# EAGLE board design1 (EAGLE 7.3.0)
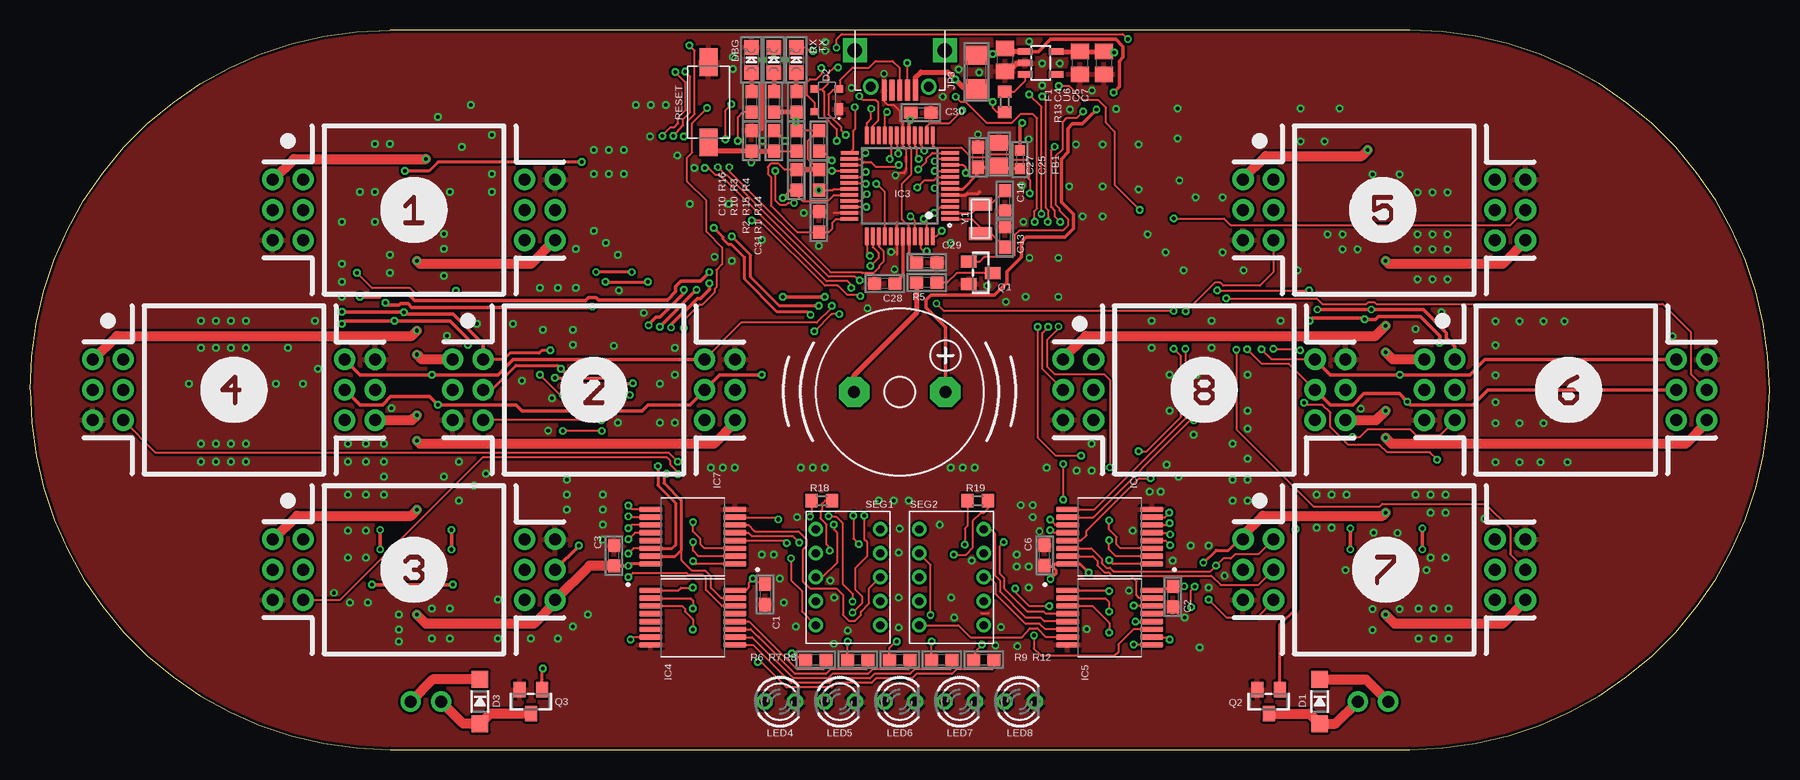
[diagram p3: board, top side]
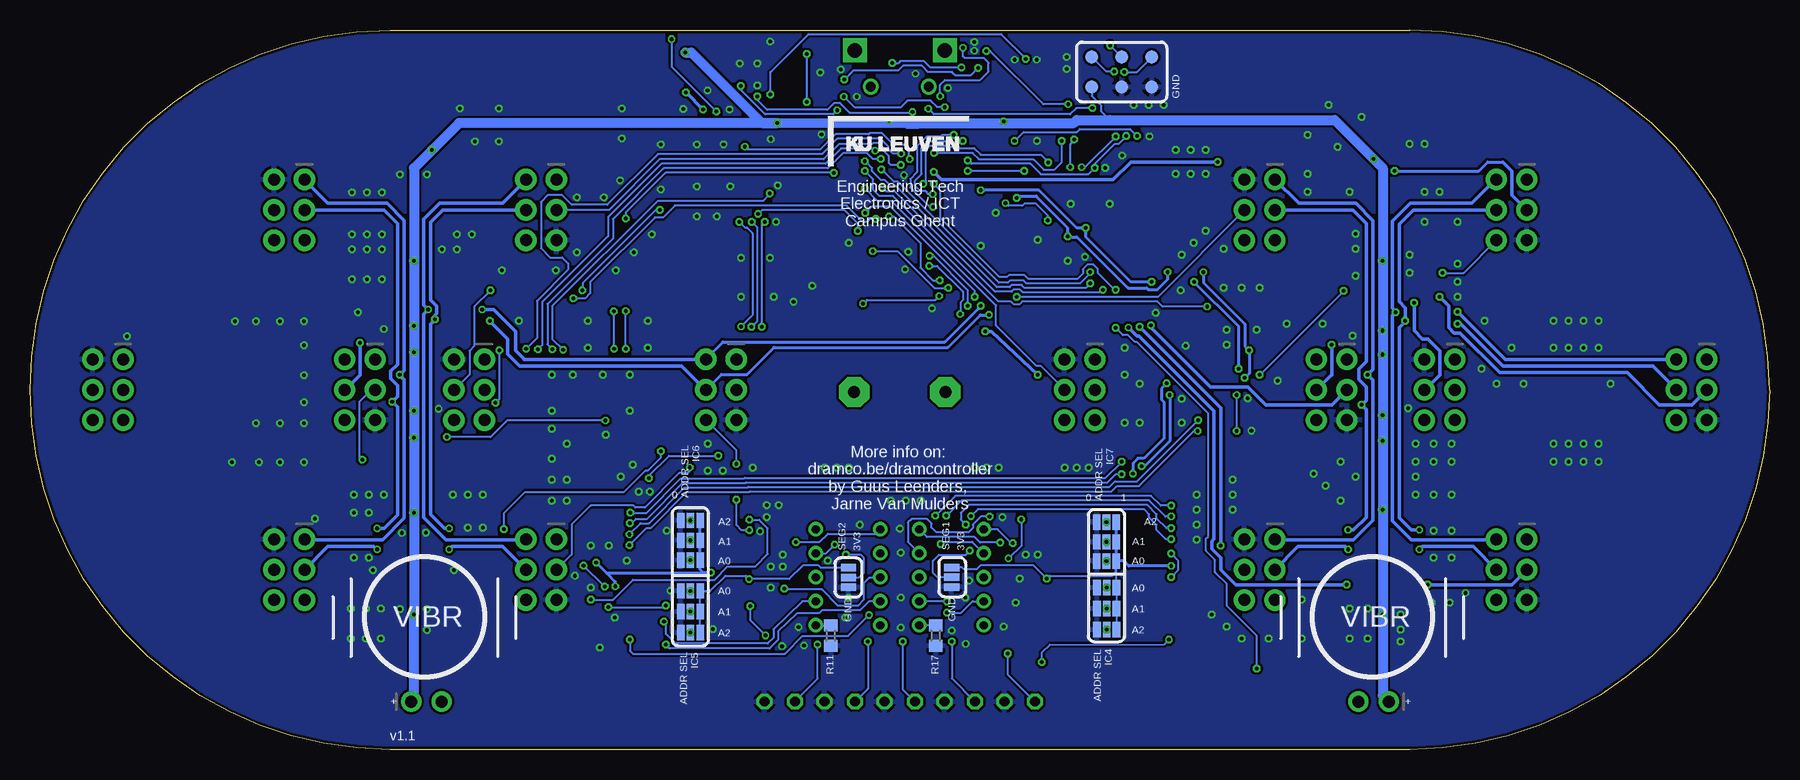
[diagram p4: board, bottom side, seen from below]

Size 145 x 60 mm. Coordinates in mm from the lower left corner, seen from the top.
Outline: 0,30 arc90 30,0 115,0 arc90 145,30 arc90 115,60 30,60 arc90 0,30
Copper layers (1*16): Top 0.035mm / dielectric 1.5mm / Bottom 0.035mm
Design rules "SeeedStudio_2layer_DRU_no_angle_20140221-2 *": minimum track width 6mil, minimum drill 11mil, track to track 1mil, track to pad 1mil, pad to pad 1mil, via to via 1mil, smd to smd 0mil, copper to edge 10mil, drill to drill 10mil, minimum pad ring 10mil, minimum via ring 6mil, stop-mask expansion 2mil, vias tented up to drill 100mil, thermal gap 10mil
Net classes: 0 default: clearance 0.205 mm

## Footprints (pad centres in the part's own frame; a part is rotated, then mirrored left to right if it is on the bottom)
F/CM12P = drill 1.016 pad 2.54 octagon: + 3.81,0; - -3.81,0
0603 = smd 1.1 x 1: 1 -0.85,0; 2 0.85,0
C0805 = smd 1.3 x 1.5: 1 -0.95,0; 2 0.95,0
0805 = smd 1.3 x 1.5: 1 -0.95,0; 2 0.95,0
SOD-123 = smd 1.4 x 1.4: A 1.85,0; C -1.85,0
SOT143B = smd 1 x 0.7: 1 -0.75,-1 | smd 0.6 x 0.7: 2 0.95,-1; 3 0.95,1; 4 -0.95,1
CHIPLED_0805 = smd 1.2 x 1.2: A 0,-1.05; C 0,1.05
1206 = smd 1.6 x 1.8: 1 -1.4,0; 2 1.4,0
_0603 = smd 0.9 x 0.8: 1 -0.762,0; 2 0.762,0
QFP50P900X900X120-48N = smd 1.45 x 0.3: 1 -4.2,2.75; 2 -4.2,2.25; 3 -4.2,1.75; 4 -4.2,1.25; 5 -4.2,0.75; 6 -4.2,0.25; 7 -4.2,-0.25; 8 -4.2,-0.75; 9 -4.2,-1.25; 10 -4.2,-1.75; 11 -4.2,-2.25; 12 -4.2,-2.75; 25 4.17,-2.75; 26 4.2,-2.25; 27 4.2,-1.75; 28 4.2,-1.25; 29 4.2,-0.75; 30 4.2,-0.25; 31 4.2,0.25; 32 4.2,0.75; 33 4.2,1.25; 34 4.2,1.75; 35 4.2,2.25; 36 4.2,2.75 | smd 0.3 x 1.45: 13 -2.75,-4.2; 14 -2.25,-4.2; 15 -1.75,-4.2; 16 -1.25,-4.2; 17 -0.75,-4.2; 18 -0.25,-4.2; 19 0.25,-4.2; 20 0.75,-4.2; 21 1.25,-4.2; 22 1.75,-4.2; 23 2.25,-4.2; 24 2.75,-4.2; 37 2.75,4.2; 38 2.25,4.2; 39 1.75,4.2; 40 1.25,4.2; 41 0.75,4.2; 42 0.25,4.2; 43 -0.25,4.2; 44 -0.75,4.2; 45 -1.25,4.2; 46 -1.75,4.2; 47 -2.25,4.2; 48 -2.75,4.2
SSOP-16 = smd 1.9 x 0.48: 1 -3.505,2.275; 2 -3.505,1.625; 3 -3.505,0.975; 4 -3.505,0.325; 5 -3.505,-0.325; 6 -3.505,-0.975; 7 -3.505,-1.625; 8 -3.505,-2.275; 9 3.505,-2.275; 10 3.505,-1.625; 11 3.505,-0.975; 12 3.505,-0.325; 13 3.505,0.325; 14 3.505,0.975; 15 3.505,1.625; 16 3.505,2.275
SMT-JUMPER_3_NO_NO-SILK = smd 0.635 x 1.27: 1 -0.813,0; 2 0,0; 3 0.813,0
FCI-10103594-0001LF = smd 0.4 x 1.75: 1 -1.3,5.025; 2 -0.65,5.025; 3 0,5.025; 4 0.65,5.025; 5 1.3,5.025 | drill 0.8: P$1 -2.425,4.73; P$2 2.425,4.73 | drill 1.2 pad 2 square: P$3 -3.75,1.7; P$4 3.75,1.7
1X02_ROUND = drill 1 pad 1.676: 1 -1.27,0; 2 1.27,0
2X03_ROUND_70MIL = drill 1 pad 1.778: 1 -2.54,1.27; 2 -2.54,-1.27; 3 0,1.27; 4 0,-1.27; 5 2.54,1.27; 6 2.54,-1.27
LED3MM = drill 0.813 octagon: A -1.27,0; K 1.27,0
SOT23-WIDE = smd 1 x 1.27: 1 -0.95,-1; 2 0.95,-1; 3 0,1
R0603 = smd 1 x 1.1: 1 -0.85,0; 2 0.85,0
434111043826 = smd 2.3 x 1.5: 1 -3.35,0; 2 3.35,0
NAR131SH-F = drill 0.7: 1 -2.685,4; 2 -2.685,2; 3 -2.685,0; 4 -2.685,-2; 5 -2.685,-4; 6 2.685,-4; 7 2.685,-2; 8 2.685,0; 9 2.685,2; 10 2.685,4
TP11R = smd 1.1 x 1.1: TP 0,0
SOT25 = smd 0.55 x 1.2: 1 -0.95,-1.3; 2 0,-1.3; 3 0.95,-1.3; 4 0.95,1.3; 5 -0.95,1.3
XTAL320X150X90 = smd 1.092 x 1.905: 1 -1.219,0; 2 1.219,0

## Placement (x,y rotation side)
BUZZER  F/CM12P  [F/CM12P]  72.5,29.81 0 top
C1  100n  [0603]  61.28,12.94 270 top
C2  100n  [0603]  95.25,12.75 270 top
C3  100n  [0603]  48.67,16.17 90 top
C4  10u  [C0805]  81.25,57.5 270 top
C5  10u  [C0805]  87.5,57.25 270 top
C6  100n  [0603]  84.58,16.19 90 top
C7  10u  [C0805]  89.5,57.25 270 top
C10  100n  [0603]  60.12,50.75 90 top
C13  12p  [0603]  81.25,42.75 270 top
C14  12p  [0603]  81.25,45.75 90 top
C25  10u  [0805]  80.78,49.63 90 top
C27  100n  [0603]  79.03,49.38 90 top
C28  100n  [0603]  71.25,38.86 180 top
C29  100n  [0603]  74.75,40.62 0 top
C30  100n  [0603]  74.26,53.1 0 top
C31  100n  [0603]  65.75,44 90 top
D1  [SOD-123]  107.5,4 270 top
D2  PRTR5V0U2X,215  [SOT143B]  66.43,54.13 90 top
D3  [SOD-123]  37.5,4 270 top
DBG  BLUE  [CHIPLED_0805]  60.12,57.5 0 top
F1  1206L025YR  [1206]  78.88,56.48 270 top
FB1  BLM18PG471SN1D  [_0603]  82.52,49.2 90 top
IC3  ATSAMD21G18A-AF  [QFP50P900X900X120-48N]  72.5,47 180 top
IC4  [SSOP-16]  55.25,11 0 top
IC5  [SSOP-16]  90,11 0 top
IC6  [SSOP-16]  90,17.75 180 top
IC7  [SSOP-16]  55.25,17.75 180 top
JP1  JUMPER-SMT_3_NO_NO-SILK  [SMT-JUMPER_3_NO_NO-SILK]  55.27,18.96 0 bottom
JP2  JUMPER-SMT_3_NO_NO-SILK  [SMT-JUMPER_3_NO_NO-SILK]  55.27,17.3 0 bottom
JP3  USB-RECEPTABLE  [FCI-10103594-0001LF]  72.5,60 180 top
JP4  JUMPER-SMT_3_NO_NO-SILK  [SMT-JUMPER_3_NO_NO-SILK]  55.27,15.71 0 bottom
JP5  [1X02_ROUND]  111.94,4 0 bottom
JP6  JUMPER-SMT_3_NO_NO-SILK  [SMT-JUMPER_3_NO_NO-SILK]  89.95,15.79 0 bottom
JP7  JUMPER-SMT_3_NO_NO-SILK  [SMT-JUMPER_3_NO_NO-SILK]  89.95,17.45 0 bottom
JP8  JUMPER-SMT_3_NO_NO-SILK  [SMT-JUMPER_3_NO_NO-SILK]  89.95,19.1 0 bottom
JP9  [2X03_ROUND_70MIL]  21.5,45 270 bottom
JP10  [2X03_ROUND_70MIL]  42.5,45 270 bottom
JP11  [2X03_ROUND_70MIL]  36.5,30 270 bottom
JP12  [2X03_ROUND_70MIL]  57.5,30 270 bottom
JP13  [2X03_ROUND_70MIL]  21.5,15 270 bottom
JP14  [2X03_ROUND_70MIL]  42.5,15 270 bottom
JP15  [2X03_ROUND_70MIL]  6.5,30 270 bottom
JP16  [2X03_ROUND_70MIL]  27.5,30 270 bottom
JP17  [2X03_ROUND_70MIL]  102.39,15 270 bottom
JP18  [2X03_ROUND_70MIL]  123.39,15 270 bottom
JP19  [2X03_ROUND_70MIL]  117.5,30 270 bottom
JP20  [2X03_ROUND_70MIL]  138.5,30 270 bottom
JP21  [2X03_ROUND_70MIL]  102.39,45 270 bottom
JP22  [2X03_ROUND_70MIL]  123.39,45 270 bottom
JP23  [2X03_ROUND_70MIL]  87.39,30 270 bottom
JP24  [2X03_ROUND_70MIL]  108.39,30 270 bottom
JP25  [1X02_ROUND]  33,4 180 bottom
JP26  JUMPER-SMT_3_NO_NO-SILK  [SMT-JUMPER_3_NO_NO-SILK]  55.25,13.5 0 bottom
JP27  JUMPER-SMT_3_NO_NO-SILK  [SMT-JUMPER_3_NO_NO-SILK]  55.25,11.75 0 bottom
JP28  JUMPER-SMT_3_NO_NO-SILK  [SMT-JUMPER_3_NO_NO-SILK]  55.25,10 0 bottom
JP29  JUMPER-SMT_3_NO_NO-SILK  [SMT-JUMPER_3_NO_NO-SILK]  89.95,9.75 0 bottom
JP30  JUMPER-SMT_3_NO_NO-SILK  [SMT-JUMPER_3_NO_NO-SILK]  89.95,11.5 0 bottom
JP31  JUMPER-SMT_3_NO_NO-SILK  [SMT-JUMPER_3_NO_NO-SILK]  89.95,13.22 0 bottom
LED4  [LED3MM]  62.5,4 0 top
LED5  [LED3MM]  67.5,4 0 top
LED6  [LED3MM]  72.5,4 0 top
LED7  [LED3MM]  77.5,4 0 top
LED8  [LED3MM]  82.5,4 0 top
Q1  [SOT23-WIDE]  79.25,39.75 270 top
Q2  [SOT23-WIDE]  103.25,4 180 top
Q3  [SOT23-WIDE]  41.75,4 180 top
R1  4k7  [0603]  65.75,47.5 270 top
R2  4k7  [0603]  63.88,47.5 270 top
R3  470  [0603]  62,54 270 top
R4  470  [0603]  63.88,54 270 top
R5  10  [0603]  74.75,38.94 180 top
R6  470  [0603]  65.5,7.5 0 top
R7  470  [0603]  69,7.5 0 top
R8  470  [0603]  72.5,7.5 0 top
R9  470  [0603]  76,7.5 0 top
R10  470  [0603]  62,50.75 270 top
R11  470  [R0603]  78.25,9.5 90 bottom
R12  470  [0603]  79.5,7.5 0 top
R13  10k  [R0603]  81.25,54 270 top
R14  100k  [0603]  65.75,50.75 90 top
R15  100k  [0603]  63.88,50.75 90 top
R16  470  [0603]  60.12,54 270 top
R17  470  [R0603]  69.5,9.5 90 bottom
R18  470  [R0603]  66,20.75 0 top
R19  470  [R0603]  79,20.75 0 top
RESET  [434111043826]  56.56,53.96 270 top
RX  BLUE  [CHIPLED_0805]  62,57.5 0 top
SEG1  327-NAR131SHF  [NAR131SH-F]  68.18,14.36 0 top
SEG2  327-NAR131SHF  [NAR131SH-F]  76.8,14.36 0 top
SJ1  JUMPER-SMT_3_NO_NO-SILK  [SMT-JUMPER_3_NO_NO-SILK]  76.78,14.34 90 bottom
SJ2  JUMPER-SMT_3_NO_NO-SILK  [SMT-JUMPER_3_NO_NO-SILK]  68.17,14.36 90 bottom
TP1  TPTP11R  [TP11R]  56.5,55.25 0 bottom
TP2  TPTP11R  [TP11R]  54,55.25 0 bottom
TP3  TPTP11R  [TP11R]  51.5,55.25 0 bottom
TP4  TPTP11R  [TP11R]  56.5,57.75 0 bottom
TP5  TPTP11R  [TP11R]  54,57.75 0 bottom
TP6  TPTP11R  [TP11R]  51.5,57.75 0 bottom
TX  BLUE  [CHIPLED_0805]  63.88,57.5 0 top
U6  LP2985AIM5-3.3  [SOT25]  84.25,57.25 270 top
Y1  ABS07W-32.768KHZ-D-2-T  [XTAL320X150X90]  79.23,44.25 90 top

## Tracks (layer width: path | path; a pad name or v marks a point on that pad's centre or on a via)
+3V3  (via drill 0.31)
  Top 0.152: IC3.36 67.19,44.25 66.88,43.94 66.88,43.44 66.59,43.15 C31.1 63.94,43.16 61.75,45.34 61.75,47.75 61.5,48 61.5,48.56 61.78,48.84 62.41,48.84 62.9,48.35 R1.1 64.81,49.29 64.81,50.75 65.66,51.6 R14.2 63.94,51.6 63.91,51.56 63.91,51.57 | 64.81,48.35 65.72,48.35 65.75,48.38 65.69,48.38 | v73.38,52.48 73.3,52.69 73.33,52.66 | R4.2 63.88,52.44 63.84,52.41 | 63.91,51.57 63.91,52.31 v63.84,52.38 | 63.91,51.57 R15.2 | IC3.44 73.25,43.64 72.69,44.2 72.69,47.2 73.42,47.93 73.42,50.19 73.25,50.36 IC3.17 | v96.22,13.59 v96.21,13.6 C2.1 95.15,13.5 94.75,13.5 94.53,13.28 IC5.16 | 59.97,13.97 v60.25,14.25 | v60.25,14.25 60.5,14 61.07,14 C1.1 | 84.71,15.47 C6.1 | IC4.16 59.69,13.28 59.93,13.52 59.93,13.93 v60.25,14.25
  Top 0.254: IC3.44 73.25,41.4 C29.1 | v88.25,14.75 87.53,15.47 IC6.16 85.47,15.47 85.25,15.25 | v97.81,15.59 97.84,15.59 98.88,16.62 99.91,16.62 100.82,17.54 JP17.1 | 85.25,15.25 84.66,15.25 C6.1 | 85.25,15.25 85.5,15 85.5,14.66 v85.06,14.22 | IC7.16 50.04,15.47 v49.88,15.31
  Top 0.305: FB1.2 82.52,52.06 v82.7,52.25 | C30.1 73.33,52.66 73.41,52.41 73.25,52.25 IC3.17 | C3.1 49.9,15.32 v49.88,15.31
  Top 0.406: R3.2 R4.2 R15.2 | R1.1 64.81,48.35 R2.1 | U6.5 C5.1 C7.1 90.38,58.2 v90.38,58.12 90.35,58.1
  Top 0.813: JP9.1 20.29,47.54 22,49.25 v33,49.25 | JP11.1 32.65,32.54 v32.25,32.94 | JP15.1 5.29,32.54 7.25,34.5 31.81,34.5 v32.25,34.94 | JP16.6 31.84,27.46 v32.25,27.88 | JP13.1 20.29,17.54 22.25,19.5 31.75,19.5 v32.25,20 | v32.25,11.25 33,10.5 42,10.5 43.77,12.27 JP14.6 46.63,15.32 C3.1 | JP12.6 58.77,27.27 57,25.5 32.5,25.5 v32.25,25.75 | JP10.6 43.71,42.46 41.75,40.5 32.5,40.5 v32.25,40.75 | JP21.1 101.12,47.62 103,49.5 111,49.5 v111.5,50 | JP22.6 124.66,42.41 122.75,40.5 113.25,40.5 v113,40.75 | JP24.6 112.21,27.46 v113,28.25 | JP23.1 86.12,32.62 88,34.5 112.16,34.5 v113,35.34 | JP20.6 139.77,27.27 138,25.5 113.5,25.5 v113,26 | JP18.6 124.66,12.41 122.75,10.5 113.75,10.5 v113,11.25 | JP17.1 101.12,17.87 102.75,19.5 112.75,19.5 v113,19.75 | D1.C 111.36,5.85 JP5.1 | D3.C 33.58,5.85 JP25.1 | JP19.1 113.58,32.54 v113,33.12
  Bottom 0.152: v73.38,52.48 73.19,52.38 v63.84,52.38 63.84,52.34 63.75,52.25 | JP26.3 JP27.3 JP28.3 | TP1.TP 56.5,54.5 55.75,53.75 55.75,53.25 55,52.5 | 89.19,9.7 JP29.3 JP30.3 JP31.3 88.31,13.22 87.03,14.5 85.34,14.5 v85.06,14.22 81.72,14.22 80.56,15.38 79.28,15.38 79.06,15.16 SJ1.3 | SJ2.3 67.31,15.19 67.16,15.03 66.09,15.03 65.78,15.34 61.34,15.34 v60.25,14.25 60,14.5 54.78,14.5 54.47,14.81 54.47,15.7 JP4.3 54.45,13.52
  Bottom 0.254: JP1.3 JP2.3 JP4.3 53.81,15.72 53.41,15.31 v49.88,15.31 | JP8.3 JP7.3 JP6.3 89.16,15.77 89.16,15.03 88.88,14.75 v88.25,14.75 88.5,14.69 96.91,14.69 | 96.91,14.69 v97.81,15.59 | v96.21,13.6 96.21,13.99 96.91,14.69 | 54.45,13.52 JP26.3
  Bottom 0.813: v90.38,58.12 89.88,58.12 84,52.25 v82.7,52.25 | v82.7,52.25 71.91,52.25 71.83,52.17 71.04,52.17 70.96,52.25 63.75,52.25 58,52.25 57.75,52.5 55,52.5 36.25,52.5 v33,49.25 32.25,48.5 v32.25,40.75 v32.25,34.94 v32.25,32.94 v32.25,27.88 v32.25,25.75 v32.25,20 v32.25,11.25 32.25,4.52 JP25.1 | v82.7,52.25 109.25,52.25 v111.5,50 113,48.5 v113,40.75 v113,35.34 v113,33.12 v113,28.25 v113,26 v113,19.75 v113,11.25 113,4.25 113.21,4.04 JP5.1
+5V  (via drill 0.31)
  Top 0.152: R13.2 80.6,53.15 80.25,53.5 v80.25,54 | v80.25,58 80,57.9 80.01,57.88
  Top 0.305: BUZZER.+ 76.31,35.24 74.69,36.85 74.69,37.49 75.09,37.89 80.41,37.89 81.44,38.92 81.44,39.87 82.63,41.06 82.63,42.33 83.03,42.73 86.28,42.73 87,43.44 87,44.63 85.96,45.66 85.96,49.24 86.52,49.79 86.52,51.78 86.92,52.17 87.71,52.17 v88.9,53.36 | v90.33,54.79 90.81,55.27 90.81,57.41 91.12,57.73 91.12,58.6 90.52,59.21 85.06,59.21 84.05,58.2 U6.1
  Top 0.406: F1.1 80.01,57.88 80.25,58.12 80.97,58.12 80.97,58.2 81.25,58.2 | U6.1 81.25,58.2 | 81.25,58.2 C4.1
  Bottom 0.152: v80.25,54 v80.25,58
  Bottom 0.305: v88.9,53.36 v90.33,54.79
A0  (via drill 0.31)
  Top 0.152: IC3.3 75.88,45.25 v75.38,44.75
  Top 0.305: v62.75,37.75 v66.25,37.75
  Bottom 0.152: JP10.4 43.77,44.98 51,37.75 v62.75,37.75 | v66.25,37.75 66.25,38.25 73.28,45.28 74.84,45.28 v75.38,44.75 75.22,44.91
A1  (via drill 0.31)
  Top 0.152: v75.41,46.81 75.84,47.25 IC3.7
  Bottom 0.152: JP12.4 58.77,30.02 60.75,32 61.09,32 64.47,35.38 64.47,37.03 73.19,45.75 74.34,45.75 v75.41,46.81
A2  (via drill 0.31)
  Top 0.152: v73.97,46.88 74.56,47.47 75.34,47.47 75.53,47.66 75.66,47.66 75.75,47.75 IC3.8
  Top 0.305: JP14.4 43.77,15.02 v45.75,17 | v52.5,35.25 52.5,35.28 v55.56,38.34
  Bottom 0.152: v55.56,38.34 55.75,38.12 62.25,38.12 62.5,38.38 63,38.38 63.19,38.19 64.56,38.19 72.91,46.53 73.62,46.53 v73.97,46.88
  Bottom 0.305: v45.75,17 45.75,28.5 v52.5,35.25
A3  (via drill 0.31)
  Top 0.152: v75.41,48.25 IC3.9
  Top 0.305: v29.62,37.25 29.81,37.06 30.75,37.06 30.88,37.19 31.5,37.19 31.81,36.88 46.81,36.88 v46.88,36.94
  Bottom 0.152: v46.88,36.94 50.59,36.94 51.03,37.38 62.28,37.38 62.53,37.12 63,37.12 63.25,37.38 64.28,37.38 73.06,46.16 74.19,46.16 74.72,46.69 74.72,47.56 v75.41,48.25
  Bottom 0.305: JP16.4 28.75,30 27.5,31.25 27.5,33.25 28.5,34.25 28.94,34.25 29.62,34.94 v29.62,37.25
A4  (via drill 0.31)
  Top 0.152: v78,48.09 78,48.53 77.78,48.75 IC3.10 | v95.34,44.28 99.53,44.28 100.06,43.75 123.41,43.75 JP22.4
  Bottom 0.152: v78,48.09 92.03,48.09 95.34,44.78 v95.34,44.28
A5  (via drill 0.31)
  Top 0.152: IC3.47 74.75,44 v74.5,44.25 | v99.72,37.62 107.25,37.62 107.72,37.16 111.41,37.16 111.56,37.31 112.06,37.31 112.22,37.16 136.09,37.16 138.44,34.81 138.44,31.33 JP20.4
  Bottom 0.152: v74.5,44.25 75,44.25 75.25,44 75.56,44 76.94,45.38 91.25,45.38 92.25,44.38 92.91,44.38 98.31,38.97 98.31,38.06 98.75,37.62 v99.72,37.62
A6  (via drill 0.31, 0.31 pad 0.3)
  Top 0.152: v100.56,33.34 100.56,26.69 106.97,20.28 112.5,20.28 112.72,20.5 121.31,20.5 123.38,18.44 123.38,16.29 JP18.4 | IC3.13 75.25,50.34 75.41,50.19 77.63,50.19 78.42,49.4 79.69,49.4 79.93,49.63 81.68,49.63 81.84,49.47 81.84,49.32 81.95,49.2 83.07,49.2 83.26,49 83.26,47.57 83.34,47.49 v83.34,46.38
  Bottom 0.152: v100.56,33.34 101.47,34.25 101.47,36.97 92.69,45.75 83.9,45.75 83.34,46.31 v83.34,46.38
A7  (via drill 0.31)
  Top 0.152: IC3.14 74.75,52 75,52.25 76.66,52.25 v77.72,53.31 | v85.75,55.34 86.6,55.34 87.79,54.16 89.06,54.16 89.69,53.52 89.69,52.25 90.41,51.54 90.41,47.09 v92.5,45 | v98.97,38.28 v106.62,38.28
  Bottom 0.152: v77.72,53.31 78.06,52.97 83.72,52.97 85.75,55 v85.75,55.34 | v106.62,38.28 107.97,36.94 107.97,33.66 108.38,33.25 108.38,31.29 JP24.4 | v92.5,45 92.84,45 98.94,38.91 98.94,38.31 v98.97,38.28
A_1  (via drill 0.31)
  Top 0.152: v81.16,17.28 80.84,16.97 80.84,14.66 81.22,14.28 81.22,13.41 83.12,11.5 84.5,11.5 84.67,11.32 IC5.4
  Bottom 0.152: v81.16,17.28 79.22,17.28 78.5,18 74.47,18 SEG2.1
A_2  (via drill 0.31)
  Top 0.152: IC7.4 62.86,17.43 v63.08,17.2
  Bottom 0.152: v63.08,17.2 63.17,17.2 64.34,18.38 65.48,18.38 SEG1.1
B_1
  Top 0.152: SEG2.10 79.5,18.34 80.09,18.34 80.47,17.97 80.47,14.5 80.84,14.12 80.84,13.19 83.03,11 84.25,11 84.58,10.68 IC5.5
B_2  (via drill 0.31)
  Top 0.152: IC7.5 59.9,18.07 60.17,17.8 63.57,17.8 v64.12,17.25
  Bottom 0.152: SEG1.10 70.25,17.72 66.28,17.72 65.81,17.25 v64.12,17.25
BUZZER_EN  (via drill 0.31 pad 0.3)
  Top 0.152: IC3.23 70.25,52.02 70.72,52.49 70.72,53.92 70.48,54.16 69.45,54.16 v69.14,54.48 | v67.23,58.52 67.23,59.24 67.65,59.66 91.1,59.66 v91.52,59.24 | v87.79,53.2 87.23,52.65 86.36,52.65 86.04,52.33 86.04,50.03 85.49,49.47 85.49,45.43 85.8,45.11 85.8,44.95 86.52,44.24 86.52,43.68 86.12,43.28 82.47,43.28 82.07,42.89 82.07,41.22 81.92,41.06 79.53,41.06 79.17,40.7 Q1.1
  Bottom 0.152: v67.23,58.52 67.23,57.81 67.07,57.65 65.48,57.65 65.09,57.25 65.09,56.54 65.8,55.82 68.74,55.82 69.14,55.43 v69.14,54.48 | v91.52,59.24 91.52,56.94 v87.79,53.2
C_1
  Top 0.152: SEG2.8 79.99,14.36 80.47,13.88 80.47,13 82.97,10.5 84.16,10.5 84.63,10.03 IC5.6
C_2
  Top 0.152: SEG1.8 69.95,13.44 69.95,12.2 69.25,11.5 69.25,11.25 68.75,10.75 68.25,10.75 67.75,11.25 67.75,12.91 67.24,13.42 65.03,13.42 64.45,13.99 64.45,16.69 64.77,17.01 64.77,17.48 64.05,18.2 60.4,18.2 59.88,18.73 IC7.6
COMMON1  (via drill 0.31)
  Top 0.152: R19.1 78.15,18.65 77.92,18.42 v77.92,17.08
  Bottom 0.152: SEG2.9 78.64,16.36 v77.92,17.08
COMMON2  (via drill 0.31)
  Top 0.152: R18.1 65.15,19.56 v65.01,19.42
  Bottom 0.152: v65.01,19.42 65.75,19.42 66.41,18.76 66.41,18.47 66.75,18.12 69.45,18.12 69.83,18.5 69.84,18.5 69.84,18.84 70.25,19.25 71.5,19.25 71.83,18.92 71.83,17.32 SEG1.9
D0  (via drill 0.31)
  Top 0.152: IC3.29 69.25,47.75 v69.67,48.17
  Top 0.254: v46,49 34,49 33.25,48.25 v31.25,48.25
  Bottom 0.254: v31.25,48.25 24.25,48.25 23.5,49 22.25,49
  Bottom 0.305: JP9.3 20.25,45 21.5,46.25 21.5,48.25 22.25,49 | v46,49 53.25,49 54.72,47.53 69.03,47.53 v69.67,48.17
D1  (via drill 0.31)
  Top 0.152: IC3.30 69.59,47.25 v69.67,47.17
  Top 0.305: v51.56,35.38 51.56,35.44 52.19,36.06 52.5,36.06 54.5,38.06 v54.5,38.34
  Bottom 0.152: 54.56,38.31 56,39.75 56,40.06 56.38,40.44 56.88,40.44 57.25,40.06 57.25,39.69 57.69,39.25 61.78,39.25 62.09,39.56 63.41,39.56 63.56,39.41 64.19,39.41 69.09,44.31 69.09,46.59 v69.67,47.17
  Bottom 0.305: JP11.3 35.25,30 36.5,28.75 42,28.75 43.5,30.25 46.62,30.25 51.56,35.19 v51.56,35.38 | v54.5,38.34 54.56,38.31
D2  (via drill 0.31)
  Top 0.152: IC3.11 75.59,49.25 v75.41,49.06
  Top 0.305: v28.5,13.75 v35.25,13.75 | v53.44,35.19 53.44,35.44 55.62,37.62 55.88,37.62 56.62,38.38 v56.62,38.88
  Bottom 0.152: v56.62,38.88 57,38.5 62.09,38.5 62.34,38.75 63.16,38.75 63.34,38.56 64.41,38.56 72.81,46.97 73.22,46.97 73.75,47.5 74.06,47.5 74.81,48.25 74.81,48.5 75.38,49.06 v75.41,49.06
  Bottom 0.305: JP13.3 20.25,15 21.5,13.75 v28.5,13.75 | v35.25,13.75 44.5,13.75 45.75,15 45.75,16 46.5,16.75 46.5,17.38 46.31,17.56 46.31,28.25 52.56,34.5 52.75,34.5 v53.44,35.19
D3  (via drill 0.31)
  Top 0.152: IC3.12 75.22,49.75 74.69,49.22 74.69,48.99 74.07,48.38 v74.03,48.38
  Top 0.305: v27.5,37.75 29.12,37.75 29.38,38 31.5,38 32.06,37.44 46.31,37.44 46.56,37.69 47.19,37.69 47.38,37.5 53.12,37.5 53.81,38.19 53.81,38.62 54.25,39.06 55.88,39.06 v56.62,39.81
  Bottom 0.152: v56.62,39.81 56.62,39.75 57.5,38.88 61.94,38.88 62.19,39.12 63.31,39.12 63.5,38.94 64.25,38.94 72.66,47.34 73,47.34 v74.03,48.38
  Bottom 0.305: JP15.3 5.25,30 6.5,28.75 9.19,28.75 11.88,31.44 22.5,31.44 25.81,34.75 26.31,34.75 26.75,35.19 26.75,37 v27.5,37.75
D4  (via drill 0.31)
  Top 0.152: IC3.27 69.28,48.75 69.53,49 70.09,49 70.48,48.6 72.27,48.6 v72.42,48.75
  Bottom 0.152: v72.42,48.75 73.25,48.75 73.41,48.91 73.41,49.5 73.84,49.94 73.84,50.16 74.25,50.56 74.75,50.56 74.81,50.5 77.56,50.5 78.84,49.22 92.53,49.22 96.75,45 JP21.3
D5  (via drill 0.31 pad 0.3)
  Top 0.152: IC3.19 72.25,49.83 v72.38,49.7 | v117.3,24.17 116.69,24.78 113.12,24.78 112.49,25.41 109.9,25.41 108.41,26.91 108.41,28.08 107.75,28.75 106.38,28.75 v106.2,28.92 | v103.64,33.41 105.76,33.41 v105.89,33.28
  Bottom 0.152: v72.38,49.7 73.07,49.7 73.46,50.08 73.46,50.28 74.12,50.94 74.88,50.94 74.9,50.92 77.72,50.92 78.99,49.65 92.66,49.65 96.88,45.44 99.85,45.44 100.64,46.22 101.85,46.22 102.41,45.66 102.41,41.8 101.65,41.04 100.64,41.04 100.13,40.53 100.13,40.02 102.75,37.4 102.75,34.3 v103.64,33.41 | JP19.3 116.55,30 117.55,29 117.55,24.38 117.35,24.17 v117.3,24.17 | v105.89,33.28 105.89,29.23 v106.2,28.92
D6  (via drill 0.31 pad 0.3)
  Top 0.152: IC3.20 71.75,49.31 v71.68,49.24 | v85.41,50.27 85.09,49.95 85.09,45.27 85.41,44.95 85.41,44.47 v85.88,44 | v85.72,35.27 85.72,35.11 84.77,34.16 84.77,31.93 85.41,31.3 89.53,31.3 90.01,30.82 v90.01,23.52
  Bottom 0.152: v85.41,50.27 85.17,50.03 79.14,50.03 77.87,51.3 75.09,51.3 75.01,51.38 73.98,51.38 73.03,50.43 72.15,50.43 71.75,50.03 71.75,49.32 v71.68,49.24 | v85.88,44 85.41,43.52 85.25,43.52 84.77,43.05 84.77,36.22 v85.72,35.27 | v90.01,23.52 90.01,23.2 90.17,23.04 90.88,23.04 93.74,20.18 94.54,20.18 94.69,20.34 98.27,20.34 99.85,18.76 99.85,16.27 JP17.3
D7  (via drill 0.31)
  Top 0.152: IC3.21 71.25,52.97 v71.44,53.16 | JP23.3 84.38,31.75 84.38,34.75 v84.88,35.25 | v84.84,44 84.84,44.34 84.91,44.41 84.91,44.94 84.69,45.16 84.69,54.16 v84.38,54.47
  Bottom 0.152: v84.88,35.25 84.38,35.75 84.38,43.53 v84.84,44 | v84.38,54.47 84.38,54.16 83.56,53.34 78.53,53.34 77.97,53.91 77.47,53.91 76.69,53.12 71.47,53.12 v71.44,53.16
D_1
  Top 0.152: SEG2.5 77.39,10.36 78.38,9.38 82.69,9.38 83.34,10.1 83.98,10.1 84.71,9.38 IC5.7
D_2  (via drill 0.31)
  Top 0.152: v63.44,15.94 63.44,14.12 64.34,13.22 64.34,11.51 SEG1.5 | IC7.7 62.19,19.38 v62.38,19.19
  Bottom 0.152: v62.38,19.19 62.38,17 v63.44,15.94
DEBUG_LED  (via drill 0.31)
  Top 0.152: 60.5,53.12 R16.2 59.4,53.15 59,52.75 v59,50.75 | IC3.26 69.25,49.25 69.64,49.64 v69.64,49.75
  Bottom 0.152: v69.64,49.75 66.44,49.75 65.91,49.22 61.38,49.22 60.5,48.34 59.62,48.34 59,48.97 v59,50.75
DP_1  (via drill 0.31)
  Top 0.152: v92.15,10.66 93.49,10.66 IC5.12
  Bottom 0.152: SEG2.7 80.61,12.36 83.03,10.03 83.03,9.31 83.5,8.83 91.2,8.83 92,9.63 92,10.5 v92.15,10.66
DP_2  (via drill 0.31)
  Top 0.152: v68.56,12.34 68.56,13 67.74,13.82 67.74,18.89 67.22,19.41 66.62,19.41 v66.56,19.47 | IC7.12 50.42,18.07 v49.88,17.53
  Bottom 0.152: v66.56,19.47 66,20.03 52.12,20.03 51.72,19.62 51.72,19.38 51.09,18.75 51.09,18.31 50.31,17.53 v49.88,17.53 | v68.56,12.34 70.85,12.34 SEG1.7
E_1  (via drill 0.31)
  Top 0.152: v92,8.76 93.47,8.76 IC5.9
  Bottom 0.152: SEG2.4 75.06,12.36 75.8,11.61 78.98,11.61 79.22,11.37 81.04,11.37 82.63,9.87 82.63,9.15 83.34,8.44 91.68,8.44 v92,8.76
E_2  (via drill 0.31)
  Top 0.152: v69.53,19.5 69.53,17.56 69.75,17.34 69.75,16.09 68.78,15.12 68.78,13.34 69.34,12.78 69.34,12.19 v68.56,11.41 | IC7.9 50.19,20.02 v49.88,20.34
  Bottom 0.152: v49.88,20.34 50.75,20.34 51.56,21.16 67.88,21.16 v69.53,19.5 | v68.56,11.41 67.39,11.41 66.42,12.38 65.51,12.38 SEG1.4
F_1  (via drill 0.31)
  Top 0.152: v75.06,11.22 75.06,15.41 SEG2.2 | IC5.10 94.78,9.38 v95,9.16
  Bottom 0.152: v95,9.16 95,8.25 94.75,8 82.07,8 80.6,9.47 76.81,9.47 v75.06,11.22
F_2  (via drill 0.31)
  Top 0.152: v68.62,19.5 68.62,17.59 v69.09,17.12 | IC7.10 49.94,19.38 v49.88,19.44
  Bottom 0.152: v68.62,19.5 67.34,20.78 51.72,20.78 50.38,19.44 v49.88,19.44 | SEG1.2 66.47,17.33 68.89,17.33 v69.09,17.12
G_1  (via drill 0.31)
  Top 0.152: v82.12,13.41 82.12,13.12 83.29,11.96 v84.97,11.96 | IC5.11 92,10.03 90.73,8.76 90.73,8.12 90.41,7.8 84.3,7.8 83.66,8.44 83.68,8.46 v83.68,9.51
  Bottom 0.152: SEG2.3 74.13,14.34 75.06,14.34 75.06,14.31 75.53,13.84 75.53,12.47 76,12 77.66,12 79,13.34 82.06,13.34 v82.12,13.41 | v84.97,11.96 84.97,10.8 v83.68,9.51
G_2  (via drill 0.31)
  Top 0.152: SEG1.3 65.51,14.34 66.03,14.34 67.31,15.62 67.31,18.04 67,18.35 v67,18.75 | v49.88,18.48 v49.88,18.47 50.13,18.73 IC7.11
  Bottom 0.152: v67,18.75 67.41,19.16 67.41,19.75 66.75,20.41 51.88,20.41 51.09,19.62 51.09,19.28 50.28,18.47 v49.88,18.47
GND  (via drill 0.31)
  Top 0.152: JP3.5 71.2,54.05 71.5,53.75 72,53.75 72.5,53.25 72.5,52.42 72.75,52.17 IC3.18 72.75,50.3 73.03,50.03 73.03,48.36 72.87,48.05 72.06,48.05 v72.14,47.89 | 72.25,41.5 IC3.42 72.25,44 | 72.25,41.5 72.25,41.25 | IC3.35 67,44.75 | C10.2 60.85,51.6 61,51.75 | v71.78,41.5 72.25,41.5 | C2.2 95.25,11.75 96,11 v96.25,11 | 79.3,11.37 79.93,11.37
  Top 0.254: IC3.5 78,46.25 78.12,46.38 79,46.38 | 61.06,53.94 61.06,57.5
  Top 0.305: 79,46.38 79.12,46.5 | 61,51.75 61,53.88 61.06,53.94
  Top 0.406: U6.2 82.25,57.25 81.55,56.55 C4.2
  other vias: 66.25,23.5 62.5,14.25 75.83,18.74 41,30.75 52.5,30.5 37.25,35.5 40.25,35.5 61,16.25 62,16.25 98.25,13.5 98.25,17 66.72,14.09 72.49,18.41 72.41,16.41 72.41,12.66 72.41,10.16 68.16,9.91 67,8.81 62.84,12.25 63.84,10.25 96.75,17 95.25,15.75 30.75,9 30.75,11.25 30.75,10 33.5,11.75 33.5,9.25 35,9.25 35,11.75 39,12.5 39,9.25 41.75,9.25 44,9.25 45.25,10.25 46.5,11.25 47.75,17.5 47.75,18.75 47.75,20 44.75,20 44.75,21.25 44.75,22.5 47.75,21.25 35.75,20.75 37,22 38,23 34.5,22.75 35.75,24 29.5,24 29.5,22.75 29.5,21.25 28,21.25 26.5,21.25 28,18.25 26.5,18.25 28,16 26.5,16 25.34,13.06 26.66,12.25 28.16,12.25 28,24 26.5,24 26.5,25.5 28,25.5 29.5,25.5 14.25,25.5 15.5,25.5 16.75,25.5 18,25.5 18,24 16.75,24 15.5,24 14.25,24 13.25,30.5 14.25,33.5 15.5,33.5 16.75,33.5 20.5,30.5 18,33.5 14.25,35.75 15.5,35.75 16.75,35.75 18,35.75 21.5,33.5 23.75,35.75 22.75,30.5 24,31.75 26,37.75 26,39 26,40.5 26,44 28.75,44 30,41.25 30,39.75 34.5,43 34.5,41.75 34.5,39.5 35,46.5 38.5,48 38.5,46.5 36,50.25 38.5,51.25 36.75,53.75 34,52.75 28.75,46.5 27.5,46.5 30,50.5 28.75,50.5 45.25,35 45.25,33.75 42.75,35 45.5,38.5 44,38.5 42.5,38.5 45.5,41.75 47,43.25 48,42.25 49,41.25 48.25,48 47,48 49.5,48 49.5,50 48.25,50 47,50 56.75,23.5 57.75,23.5 58.75,23.5 76.75,23.5 77.75,23.5 78.75,23.5 65.25,23.5 64.25,23.5 84.75,23.5 87.25,23.25 88.5,23.25 93.33,21.5 94.25,21.5 95.75,22.75 94.75,23.75 100.25,22.5 100.25,20.75 101.5,20.75 101.5,22.5 107.25,21.25 108.5,21.25 109.75,21.25 108.5,18.5 107.25,18.5 115.5,21.25 116.75,21.25 118,21.25 118,19.75 116.75,19.75 118,16 116.75,16 118.25,11.75 117,11.75 117,9.25 118.25,9.25 115.75,9.25 115.75,11.75 114,18.06 112,18.09 117.66,36.47 122.16,33.72 122.16,35.72 124.16,35.72 122.16,31.22 122.16,28.97 122.16,27.22 124.16,27.22 126.16,27.22 126.16,35.72 127.91,35.72 97.5,8.5 82.25,15.25 83.25,15.25 82.25,16.25 82.59,20.39 83.59,20.39 83.59,19.39 115.66,39.22 116.91,39.22 118.16,39.22 118.16,41.72 116.91,41.72 115.66,41.72 115.66,42.97 116.91,42.97 118.16,42.97 115.66,46.47 116.91,46.47 118.16,46.47 110.66,41.72 109.41,41.72 109.41,42.97 108.16,42.97 111.91,47.97 114.16,47.97 105.91,50.72 109.16,53.47 105.91,53.47 109.66,14.97 111.91,11.72 111.91,9.97 116.41,14.97 114.16,11.72 107.91,50.72 100.25,25.5 101.5,24.25 101.5,26.75 101.5,28.25 101.5,31.25 99.75,31.25 97.25,31.25 95,31.25 95,28.25 97,26.25 98.5,33.5 93.5,33.5 98.5,35.75 93.5,35.75 122.16,23.97 124.16,23.97 125.91,23.97 128.16,23.97 101.16,39.97 99.41,41.47 94.66,41.47 96.16,39.97 93.16,42.97 99.41,46.05 97.16,46.05 95.81,47.47 95.66,50.97 95.66,53.47 92.41,46.72 82.67,47.05 82.81,44 89.41,44.47 89.41,46.97 86.63,46.97 87.74,44.47 87.19,50.47 89.41,50.47 92.41,50.47 64.5,44.75 68.49,55.16 66.29,58.27 66.29,59 58.59,56.75 83.25,50.9 76.09,54.44 77.41,56.72 83.3,59.03 79.02,51.3 72.06,40.03 61,42.5 58.5,40.75 58.25,45.5 55,45.5 61.06,50.75 58.59,57.75 79.12,56.47 84.38,55.38 84.38,57.22 88.52,54.95 85.84,57.22 86.69,53.38 90.54,53.41 53.75,33.5 53.75,31.25 48.66,33.66 51.16,36.41 49.09,38.28 57.06,41.09 65.75,42 76.75,42.25 81.35,37.34 83,37.75 83.32,41 85.73,41 85.73,37.75 53.97,49.53 55.38,48.5 53,53.75 51.75,53.75 50.5,53.75 69.81,36.78 43.19,26.59 43.5,29.28 80.48,8.66 78.5,15.75 76.78,12.66 83.25,13.5 77.04,11 70.75,20.75 72,20.75 73.25,20.75 63.94,19.38 51.69,51.12 52.5,27.25 53.75,27.25 49,27.25 49,29.25 88.5,25.5 104.25,35.75 115.5,35.06 110.94,28.41 105.66,39.97 136.91,34.47 121.25,19.25 30.12,28.47 34.75,34.5 61.09,57.52 99.58,14.49 67.04,12.66 88.08,10.04 80.94,10.2 91.93,18.24 91.61,13.24 84.15,18.19 82.3,8.61 71.19,56.35 62.92,57.52 79.8,38.66
  pour Bottom: -11.11,60.77 177.48,60.77 177.23,-0.92 -11.36,-0.92
  pour Top: -18.23,60.89 196.08,60.89 196.08,-0.9 -18.23,-0.9
I2C_SCL  (via drill 0.31)
  Top 0.152: R2.2 64,46.12 | 64,46.12 64.38,45.75 66.5,45.75 67,46.25 IC3.32 | JP17.2 102.4,16.28 100.44,16.28 100.09,15.94 99.47,15.94 v98.86,15.33 98.41,14.88 90.31,14.88 90.03,15.16 89.72,15.16 89.34,15.53 89.34,15.91 88.47,16.77 IC6.14 | 64,46.12 64,46.53 | v96.78,11.88 96.78,13.28 v97.09,13.59 | v49.88,14.38 50.25,14.75 54.73,14.75 54.92,14.56 56.09,14.56 56.34,14.31 56.34,13.31 57.68,11.97 IC4.14 | IC5.14 92.03,11.97 v92,12 | IC7.14 50.31,16.77 v49.88,16.34
  Top 0.254: 64,46.53 63.84,46.69 63.44,46.69 v62.75,46 | v50.16,39.81 v47.19,39.81 | v43.38,33.28 42.66,33.28 42.44,33.06 40,33.06 39.47,32.53 JP11.2 | v43.75,31 48.5,31 49.94,29.56 v50,29.56 | v52.34,23.62 52.34,22.03 53.81,20.56 53.81,17.06 53.52,16.77 IC7.14 | v65.75,37 62.47,37 60.06,39.41 60.06,41.22 v58.5,42.78
  Top 0.305: JP19.2 118.77,33.59 118.06,34.3 118.06,34.75 116.12,36.69 v111.81,36.69 v107.31,36.69 | JP11.2 37.77,33.79 35.25,36.31 31.31,36.31 v31.16,36.47 31.12,36.5 v26,36.5
  Bottom 0.152: v97.09,13.59 97.12,13.59 v98.86,15.33 | v49.88,14.38 49.28,14.97 49.28,15.75 v49.88,16.34 | v96.78,11.88 92.12,11.88 v92,12
  Bottom 0.254: v62.75,46 62.75,46.03 62.62,46.16 61.12,46.16 61.12,46.12 58.5,43.5 v58.5,42.78 58.47,42.75 57.75,42.75 53.47,38.5 51.94,38.5 51.78,38.34 51.03,38.34 50.16,39.22 v50.16,39.81 | v47.19,39.81 47.19,38.94 43.72,35.47 43.72,33.62 v43.38,33.28 43.38,31.38 v43.75,31 | v50,29.56 50,25.72 52.09,23.62 v52.34,23.62 | JP23.2 88.66,32.59 87.25,34 68.75,34 v65.75,37
  Bottom 0.305: JP17.2 103.7,17.5 110.31,17.5 112.19,19.38 112.19,36.31 v111.81,36.69 112.19,37.06 112.19,44.25 110.88,45.56 105.62,45.56 103.66,47.53 JP21.2 | JP23.2 103.8,32.54 103.8,32.55 104.54,33.28 104.54,34.87 106.36,36.7 v107.31,36.69 | 31.16,36.53 31.12,36.5 v31.16,36.47 | v31.16,36.47 31.44,36.19 31.44,19.06 29.88,17.5 22.81,17.5 JP13.2 | JP9.2 22.84,47.54 24.81,45.56 29.94,45.56 31.44,44.06 31.44,36.81 31.16,36.53 | v31.16,36.47 31.16,36.53 | JP15.2 22.04,32.54 v26,36.5
I2C_SDA  (via drill 0.31)
  Top 0.152: IC3.31 67,46.75 66.9,46.65 R1.2 | 91.76,14.5 90.16,14.5 89.88,14.78 89.56,14.78 88.97,15.38 88.97,15.75 88.59,16.12 IC6.15 | 91.76,14.5 98.47,14.5 99.25,13.72 102.38,13.72 JP17.4 | 54.28,17.12 54.31,17.09 54.31,15.78 55.16,14.94 56.25,14.94 56.75,14.44 56.75,13.5 57.62,12.62 IC4.15 | IC5.15 92.49,12.62 92.23,12.88 92.23,14.02 91.76,14.5
  Top 0.254: 38.47,30 40.5,32.03 43.97,32.03 v44.25,31.75 44.28,31.75 44.53,31.5 48.69,31.5 49.66,30.53 v50.25,30.53 | v47.97,39 v51.5,39 | v53.06,23 52.84,22.78 52.84,22.22 54.28,20.78 54.28,17.12 54.28,16.62 53.78,16.12 IC7.15 | v65.06,36.25 64.81,36.5 62.28,36.5 59.56,39.22 59.56,41.03 58.47,42.12 58.22,42.12 57.78,42.56 57.78,42.72 v57,43.5 | R1.2 65.75,46.56 66.09,46.22 66.09,46.31 R1.2
  Top 0.305: v110.06,18.44 v110.06,16.69 | v117.5,33.91 117.5,34.5 115.88,36.12 112.38,36.12 112.12,35.88 v111.25,35.88 111.16,35.97 106.89,35.97 v106.68,35.75 | v29.19,18.31 v29.19,16.69 | v36.5,33.75 36.5,34.25 35,35.75 v30.38,35.75 26.25,35.75 v26,35.5 | 38.47,30 JP11.4
  Bottom 0.254: v44.25,31.75 44.25,35.28 v47.97,39 | v51.5,39 53.25,39 57,42.75 v57,43.5 57.75,43.5 60.91,46.66 R1.2 | v50.25,30.53 50.69,30.09 50.69,29.19 50.5,29 50.5,25.94 52.16,24.28 52.66,24.28 53.06,23.88 v53.06,23 | JP23.4 87.38,31.28 85.25,31.28 83,33.53 68.5,33.53 65.78,36.25 v65.06,36.25
  Bottom 0.305: JP21.4 110.62,45 111.62,44 111.62,37.5 111.12,37 111.12,36.38 111.25,36.25 v111.25,35.88 111.62,35.5 111.62,19.62 110.44,18.44 v110.06,18.44 | v110.06,16.69 109.81,16.94 105.6,16.94 JP17.4 | JP19.4 118.75,30 117.5,31.25 v117.5,33.91 | JP23.4 88.69,30 90.69,32 104.21,32 105.17,32.96 105.17,34.24 v106.68,35.75 | JP9.4 29.69,45 30.88,43.81 30.88,37.38 30.38,36.81 v30.38,35.75 30.38,35.69 30.88,35.19 30.88,19.31 29.88,18.31 v29.19,18.31 | v29.19,16.69 28.94,16.94 24.71,16.94 JP13.4 | v36.5,33.75 36.5,31.25 36.52,31.25 JP11.4 | JP15.4 7.77,30.02 9.75,32 22.25,32 25.75,35.5 v26,35.5
  other vias: 65.75,46.65
IO_EXP1_A0  (via drill 0.31)
  Top 0.152: IC7.1 55.5,15.47 JP4.2
  Bottom 0.152: JP4.2 55.27,16.2 55.25,16.22 55.25,15.73 JP4.2
  other vias: 55.27,15.71
IO_EXP1_A1  (via drill 0.31)
  Top 0.152: JP2.2 55.25,17.29 55.25,16.59 55.72,16.12 IC7.2
  Bottom 0.152: JP2.2 55.27,16.98 55.5,16.75 55.5,17.07 JP2.2
  other vias: 55.27,17.3
IO_EXP1_A2  (via drill 0.31)
  Top 0.152: JP1.2 55.25,18.95 55.25,18.19 55.88,17.56 55.88,17.12 56.23,16.77 IC7.3
  Bottom 0.152: JP1.2 55.27,18.58 55.41,18.44 55.41,18.82 JP1.2
  other vias: 55.27,18.96
IO_EXP2_A0  (via drill 0.31)
  Top 0.152: IC6.1 90.26,15.47 JP6.2
  Bottom 0.152: JP6.2 89.95,15.3 90,15.25 90,15.74 JP6.2
  other vias: 89.95,15.79
IO_EXP2_A1  (via drill 0.31)
  Top 0.152: JP7.2 89.94,17.43 89.94,16.69 90.5,16.12 IC6.2
  Bottom 0.152: JP7.2 89.95,16.96 90,16.91 90,17.39 JP7.2
  other vias: 89.95,17.45
IO_EXP2_A2  (via drill 0.31)
  Top 0.152: JP8.2 89.94,19.09 89.94,18.34 90.56,17.72 90.56,17.12 90.91,16.77 IC6.3
  Bottom 0.152: JP8.2 89.95,18.74 90.09,18.59 90.09,18.95 JP8.2
  other vias: 89.95,19.1
IO_EXP3_A0  (via drill 0.31)
  Top 0.152: IC4.1 54.02,13.28 54.25,13.5 JP26.2
  other vias: 55.25,13.5
IO_EXP3_A1  (via drill 0.31)
  Top 0.152: JP27.2 55.25,12.44 55.06,12.62 IC4.2
  other vias: 55.25,11.75
IO_EXP3_A2  (via drill 0.31)
  Top 0.152: JP28.2 55.25,10.84 54.59,11.5 54.59,11.75 54.37,11.97 IC4.3
  Bottom 0.152: 55.25,9.5 JP28.2
  other vias: 55.25,10
IO_EXP4_A0  (via drill 0.31)
  Top 0.152: IC5.1 89.89,13.28 JP31.2
  Bottom 0.152: JP31.2 89.95,12.86 90.09,12.72 90.09,13.07 JP31.2
  other vias: 89.95,13.22
IO_EXP4_A1  (via drill 0.31)
  Top 0.152: JP30.2 89.94,11.51 89.94,12.31 89.62,12.62 IC5.2
  Bottom 0.152: JP30.2 89.95,11.18 90.16,10.97 90.16,11.29 JP30.2
  other vias: 89.95,11.5
IO_EXP4_A2  (via drill 0.31)
  Top 0.152: JP29.2 89.97,9.77 89.97,10.56 88.56,11.97 IC5.3
  Bottom 0.152: JP29.2 89.95,9.36 90.09,9.22 90.09,9.61 JP29.2
  other vias: 89.95,9.75
IO_EXP_INT  (via drill 0.31)
  Top 0.152: v93.41,22.62 92.44,22.62 88.06,18.25 88.06,17.88 87.61,17.43 IC6.13 | v87.62,24.5 85.5,24.5 84,26 v84,35.25 | v83.75,44 83.75,44.34 83.72,44.38 83.72,44.91 83.94,45.12 83.94,52.66 83.59,53 82.58,53 81.83,52.25 79.75,52.25 78,54 77.59,54 v77.16,54.44 | v68.75,53.56 68.75,51.72 68.59,51.56 68.59,50.01 IC3.25
  Bottom 0.152: v93.41,22.62 93.41,22.84 91.75,24.5 v87.62,24.5 | v84,35.25 84,43.75 v83.75,44 | v68.75,53.56 68.8,53.59 69.4,53.59 69.92,54.11 71.86,54.11 72.44,53.53 76.25,53.53 v77.16,54.44
LDO_EN
  Top 0.152: R13.1 82.05,54.85 82.95,55.75 U6.3
LED1
  Top 0.152: R6.2 66.35,6.88 66.16,6.69 63.94,6.69 59.95,10.68 IC4.12
LED2
  Top 0.152: R7.2 69.85,6.85 69.69,6.69 66.72,6.69 66.34,6.31 63.78,6.31 60.8,9.3 60.66,9.44 60.07,10.03 IC4.11
LED3
  Top 0.152: R8.2 73.35,6.85 73.19,6.69 70.22,6.69 69.84,6.31 66.88,6.31 66.5,5.94 63.62,5.94 60.19,9.38 IC4.10
LED4
  Top 0.152: R9.2 76.85,6.85 76.69,6.69 73.72,6.69 73.34,6.31 70.38,6.31 70,5.94 67.03,5.94 66.66,5.56 63.44,5.56 60.27,8.72 IC4.9
LED5  (via drill 0.31)
  Top 0.152: R12.2 80.35,6.85 80.19,6.69 77.22,6.69 76.84,6.31 73.88,6.31 73.5,5.94 70.53,5.94 70.16,5.56 67.19,5.56 66.81,5.19 63.06,5.19 60.97,7.28 v60.66,7.28 | IC4.7 50.28,9.38 v50.06,9.16
  Bottom 0.152: v60.66,7.28 60.66,8.09 60,8.75 50.44,8.78 v50.06,9.16
N$1
  Top 0.406: RX.A R3.1
N$2
  Top 0.406: R4.1 TX.A
N$3
  Top 0.406: BUZZER.- 68.69,31.19 73.9,36.4 R5.2
N$4
  Top 0.305: IC3.43 72.75,39.59 C28.1
N$5
  Top 0.152: Q1.3 77.25,39.75 76.44,38.94 R5.1
N$6
  Top 0.254: IC3.6 77.75,46.75 79.03,48.03 C27.1
  Top 0.305: FB1.1 80.75,48.44 C25.1 80.35,48.53 C27.1
N$7  (via drill 0.31)
  Top 0.152: JP3.1 73.8,55.55 | 79.09,55.12 F1.2 | D2.4 65.43,53.89 64.77,54.55 64.77,55.67 65.01,55.9 65.56,55.9 65.96,56.3 v65.96,56.84
  Top 0.406: 73.8,55.55 73.8,56.05 74.25,56.5 76.5,56.5 v77.12,55.88 77.92,55.09 F1.2
  Bottom 0.152: 76.5,56.5 v77.12,55.88 76.38,56.62 72.63,56.62 72.23,57.02 70.64,57.02 70.13,56.5 68.14,56.5 67.87,56.22 66.58,56.22 v65.96,56.84
N$8
  Top 0.813: JP25.2 36.12,2.15 D3.A 38.35,3 Q3.3
N$9
  Top 0.152: IC3.1 78.5,44.25 79.23,43.52 Y1.1 80.12,43.03 C13.2
N$10
  Top 0.152: IC3.2 78.51,44.75 Y1.2 80.12,45.47 C14.2
N$13
  Top 0.406: DBG.A R16.1
N$16  (via drill 0.31)
  Top 0.152: R10.1 62.09,51.6 v62.94,50.75 | v53.78,56.5 54.66,55.62 54.66,53.31 54.03,52.69 54.03,52.22 53.72,51.91 53.41,51.91 52.72,51.22 v52.72,51.16
  Bottom 0.152: v62.94,50.75 62.19,51.5 57.75,51.5 57.5,51.75 53.31,51.75 v52.72,51.16 | v53.78,56.5 52.75,56.5 TP6.TP
N$17
  Bottom 0.152: R17.2 70.86,10.35 SEG1.6
N$18
  Top 0.813: Q2.3 106.65,3 D1.A 108.82,2.15 JP5.2
N$19  (via drill 0.31)
  Top 0.152: v79.35,8.75 78.75,8.15 78.75,7.6 R12.1
  Bottom 0.152: LED8.A 81.23,4.02 79.35,5.9 v79.35,8.75
N$20  (via drill 0.31)
  Top 0.152: v63.5,8 63.75,8 64.25,7.5 R6.1
  Bottom 0.152: LED4.A 61.25,4.02 61.27,4.02 63.5,6.25 v63.5,8
N$21  (via drill 0.31)
  Top 0.152: R7.1 68.15,8.74 v68.16,9
  Bottom 0.152: v68.16,9 68.16,5.93 LED5.A
N$22  (via drill 0.31)
  Top 0.152: R8.1 71.65,8.5 72.15,9 v72.25,9
  Bottom 0.152: LED6.A 71.25,4 72.25,5 v72.25,9
N$23  (via drill 0.31)
  Top 0.152: R9.1 v75.15,8.99 v75.16,9
  Bottom 0.152: v75.16,9 75.16,5.07 LED7.A
N$24
  Bottom 0.152: SEG2.6 R11.2
N$25  (via drill 0.31)
  Top 0.152: v77,16.25 78,16.25 78.59,16.84 78.59,19.09 79.25,19.75 79.5,19.75 79.85,20.1 R19.2
  Bottom 0.152: SJ1.2 75.91,14.34 75.5,14.75 75.5,16 75.75,16.25 v77,16.25
N$26  (via drill 0.31)
  Top 0.152: v66.66,16.58 66.66,16.84 66.41,17.09 66.41,18.76 65.88,19.29 65.88,19.87 66,19.99 66,20.5 66.25,20.75 R18.2
  Bottom 0.152: SJ2.2 69.36,14.36 69.75,14.75 69.75,15.75 69.25,16.25 66.99,16.25 v66.66,16.58
RESET  (via drill 0.31)
  Top 0.152: 62.15,49.9 62,49.75 | IC3.40 71.25,46.5 v70.55,47.17 | v60.12,48.97 C10.1 | 62.15,49.9 R15.1 | 62.15,49.9 R10.2
  Top 0.406: R10.2 C10.1 56.6,49.9 56.5,50 56.5,50.55 RESET.2 56.58,50.62
  Bottom 0.152: v70.55,47.17 70.3,47.42 70.3,50.02 69.97,50.34 68.47,50.34 68.41,50.28 67.62,50.28 67.5,50.16 66.31,50.16 65.75,49.59 60.75,49.59 v60.12,48.97
RXLED  (via drill 0.31)
  Top 0.152: IC3.48 75.55,42.8 v76,43.25 | v84.31,44.66 84.31,53.59 v83.28,54.62 | v62,57.59 RX.C
  Bottom 0.152: v76,43.25 76,43.88 77.12,45 83.97,45 v84.31,44.66 | v62,57.59 64.06,59.66 80.12,59.66 83.28,56.5 v83.28,54.62
S1_I2C_INT  (via drill 0.31)
  Top 0.152: v47.66,26.56 v44.41,26.56 | v35.5,38.25 35.16,37.91 32.25,37.91 31.69,38.47 28.53,38.47 v27.25,39.75 | v44.41,29.56 44.19,29.56 v42.5,31.25 | IC6.4 94.64,17.43 v95.03,17.03
  Bottom 0.152: v95.03,17.03 95.03,17.06 93.62,18.47 93.25,18.47 90.26,21.46 85.04,21.46 84.97,21.53 54.84,21.53 54.41,21.97 52.56,21.97 47.97,26.56 v47.66,26.56 | v44.41,26.56 v44.41,29.56 | v42.5,31.25 v35.5,38.25 | v27.25,39.75 25.48,39.75 JP9.6
S2_I2C_INT  (via drill 0.31)
  Top 0.152: v47.62,27.47 JP11.6 | IC6.5 94.89,18.07 v95.03,17.94
  Bottom 0.152: v95.03,17.94 95.03,17.97 94.12,18.88 93.41,18.88 90.44,21.84 85.19,21.84 85.12,21.91 55.03,21.91 54.56,22.38 52.72,22.38 v47.62,27.47
S3_I2C_INT  (via drill 0.31)
  Top 0.152: JP13.6 25.84,12.46 37.72,24.34 53.09,24.34 53.38,24.06 53.38,23.75 54,23.12 v54,22.97 | IC6.6 94.85,18.73 v95,18.88
  Bottom 0.152: v95,18.88 94.88,18.88 94.5,19.25 93.56,19.25 90.6,22.21 85.35,22.21 85.28,22.28 55.19,22.28 54.5,22.97 v54,22.97
S4_I2C_INT  (via drill 0.31)
  Top 0.152: v54,24 53.25,24.75 10.48,24.75 JP15.6 | IC6.7 94.59,19.38 v94.97,19.75
  Bottom 0.152: v94.97,19.75 93.59,19.75 90.76,22.59 85.51,22.59 85.44,22.66 55.34,22.66 v54,24
S5_I2C_INT  (via drill 0.31)
  Top 0.152: JP21.6 103.66,39.82 102.53,38.69 99.47,38.69 99.22,38.94 98.75,38.94 v96.34,36.53 | v96.31,33.41 96.31,27.59 88.74,20.02 IC6.9
  Bottom 0.152: v96.34,36.53 96.34,33.44 v96.31,33.41
S6_I2C_INT  (via drill 0.31)
  Top 0.152: v110.25,26.06 110.84,26.06 111.5,26.72 115.03,26.72 115.5,26.25 117.56,26.25 JP19.6 | v97.03,27.44 96.69,27.44 88.62,19.38 IC6.10
  Bottom 0.152: v97.03,27.44 105.25,27.44 106.62,26.06 v110.25,26.06
S7_I2C_INT  (via drill 0.31)
  Top 0.152: JP17.6 103.66,12.41 102.25,11 99.75,11 v98.25,12.5 | IC6.11 85.46,18.73 v85.03,19.16
  Bottom 0.152: v98.25,12.5 96.41,12.5 94.75,14.16 87.94,14.16 86.84,15.26 84.53,15.26 83.5,16.3 83.5,18.44 84.22,19.16 v85.03,19.16
S8_I2C_INT  (via drill 0.31)
  Top 0.152: v86.12,20.83 v86.12,23.81 | IC6.12 85.24,18.07 v85.03,18.28
  Bottom 0.152: v85.03,18.28 85.69,18.28 86.12,18.72 v86.12,20.83 | JP23.6 86.12,24.93 v86.12,23.81
SERIAL1_RX  (via drill 0.31)
  Top 0.152: JP24.3 107.09,30 104.95,32.15 102.7,32.15 v101.47,33.38 | IC3.16 73.75,50.34 73.9,50.19 73.9,49.43 v74.08,49.25
  Top 0.305: v116.06,18.44 v116.06,16.69 | JP24.3 108.38,28.75 110.25,28.75 111.19,29.69 114.12,29.69 v114.81,29 115.06,28.75 120.25,28.75 121.5,30 JP20.3
  Bottom 0.152: v74.08,49.25 74.72,49.25 75.22,49.75 77.22,49.75 78.5,48.47 92.19,48.47 96.41,44.25 96.41,42.62 101.88,37.16 101.88,33.78 v101.47,33.38
  Bottom 0.305: JP22.3 115.5,45 114.38,43.88 114.38,32.12 114.94,31.56 114.94,30.94 114.38,30.38 114.38,29.44 v114.81,29 114.38,28.56 114.38,19.56 115.5,18.44 v116.06,18.44 | v116.06,16.69 116.12,16.69 116.38,16.94 120.18,16.94 JP18.3
SERIAL1_TX  (via drill 0.31)
  Top 0.152: JP24.1 107.1,32.56 103.47,32.56 v102.66,33.38 | IC3.15 74.25,50.39 74.55,50.09 v74.55,49.94
  Top 0.305: JP24.1 107.12,32.51 108.38,31.25 v114.19,31.25 120,31.25 121.29,32.54 JP20.1
  Bottom 0.152: v74.55,49.94 74.74,50.12 77.41,50.12 78.69,48.84 92.38,48.84 96.81,44.41 96.81,42.81 102.31,37.31 102.31,33.72 v102.66,33.38
  Bottom 0.305: v114.19,31.25 113.81,31.62 113.81,44.12 115.25,45.56 120.19,45.56 122.12,47.49 JP22.1 | v114.19,31.25 113.81,30.88 113.81,30.81 | 113.81,30.81 113.81,19.31 115.62,17.5 122.08,17.5 JP18.1 | v114.19,31.25 114.19,31.19 113.81,30.81
SERIAL_RX  (via drill 0.31)
  Top 0.152: IC3.38 70.25,41.89 70.72,41.42 70.72,41 v70.05,40.33 | v67.47,36.31 66.81,36.31 v65.38,34.88
  Top 0.305: v35.12,18.31 v35.12,16.69 | JP16.3 26.25,30 27.5,28.75 29.38,28.75 30.06,29.44 33.31,29.44 v34,28.75 40.5,28.75 41,28.25 51,28.25 51.5,28.75 55,28.75 56.23,29.98 JP12.3 57.48,31.25 v61,31.25
  Bottom 0.152: v70.05,40.33 69.39,40.33 67.25,38.19 67.25,37.47 67.44,37.28 67.44,36.34 v67.47,36.31
  Bottom 0.305: JP10.3 34.75,45 33.62,43.88 33.62,32.38 34.25,31.75 34.25,30.88 33.62,30.25 33.62,29.12 v34,28.75 33.62,28.38 33.62,19.38 34.69,18.31 v35.12,18.31 | v35.12,16.69 35.38,16.94 39.29,16.94 JP14.3 | v65.38,34.88 64.88,34.88 v61,31.25
SERIAL_TX  (via drill 0.31)
  Top 0.152: JP12.1 59.28,35.59 65.56,35.59 66.84,36.88 v66.84,37 | IC3.37 69.75,41.44 v70.01,41.17
  Top 0.305: JP12.1 40.29,32.54 39,31.25 v33.5,31.25 27.5,31.25 26.23,32.52 JP16.1
  Bottom 0.152: v70.01,41.17 69.7,41.17 66.84,38.31 v66.84,37
  Bottom 0.305: JP14.1 41.19,17.5 34.69,17.5 33.06,19.12 33.06,30.81 v33.5,31.25 33.06,31.69 33.06,44.12 34.5,45.56 39.25,45.56 JP10.1
SWCLK  (via drill 0.31)
  Top 0.152: IC3.45 73.75,44.1 v73.39,44.45 | v69.16,39.12 69.09,39.12 68.78,39.44 66.56,39.44 58.12,47.88 58.03,47.88 v57.34,48.56 | v54.5,51.12 54.81,51.44 54.81,52.41 55.41,53 55.41,58.28 v54.97,58.72
  Bottom 0.152: v73.39,44.45 72.99,44.45 70.78,42.25 70.78,40.19 69.72,39.12 v69.16,39.12 | v57.34,48.56 57.06,48.56 v54.5,51.12 | TP5.TP v54.97,58.72
SWDIO  (via drill 0.31)
  Top 0.152: v74.75,41.56 74.47,41.56 74.25,41.78 IC3.46 | v68.45,38.5 68.45,38.76 68.16,39.06 66.41,39.06 57.97,47.5 57.88,47.5 57.47,47.91 57.16,47.91 56.56,48.5 v56.25,48.5 | v53.62,51.16 54.44,52.06 54.44,52.56 55.03,53.16 55.03,56.12 v54.62,56.53 | R14.1 66.07,49.9 v66.84,49.12
  Bottom 0.152: v74.75,41.56 72.69,41.56 69.62,38.5 v68.45,38.5 | v54.62,56.53 55.28,56.53 TP4.TP | v66.84,49.12 66.56,48.84 61.62,48.84 60.75,47.97 56.78,47.97 v56.25,48.5 56.25,48.84 54.59,50.5 54.28,50.5 v53.62,51.16
TARGET_USB_N  (via drill 0.31)
  Top 0.152: JP3.2 73.15,57.23 v73.12,57.25 | D2.3 65.38,55.05 66.03,55.05 | v67.25,50.75 67.25,51.75 66.2,52.8 66.2,54.87 66.03,55.05 | v69.75,46.31 69.19,45.75 IC3.33 | 66.03,55.05 66.05,55.05 66.52,55.51 66.52,56.38 67.01,56.88 v67.35,56.88
  Bottom 0.152: v73.12,57.25 72.62,57.25 72.46,57.41 70.48,57.41 69.95,56.88 v67.35,56.88 | v69.75,46.31 70.09,46.31 70.33,46.55 70.76,46.55 71.25,47.03 71.25,47.42 70.67,48 70.67,50.17 70.12,50.72 68.31,50.72 68.25,50.66 67.34,50.66 v67.25,50.75
TARGET_USB_P  (via drill 0.31)
  Top 0.152: v68,51.25 67.62,51.62 67.62,51.88 66.55,52.95 66.55,54.62 66.92,54.99 D2.2 67.5,55.06 67.5,55.81 68.57,56.88 69.95,56.88 70.48,57.41 71.91,57.41 72.5,56.83 JP3.3 | v69.72,45.25 IC3.34
  Bottom 0.152: v68,51.25 68.97,51.25 69.12,51.09 70.28,51.09 71.05,50.33 71.05,48.16 71.62,47.58 71.62,46.88 70,45.25 v69.72,45.25
TXLED  (via drill 0.31)
  Top 0.152: IC3.39 70.75,41.95 71.16,41.55 71.16,40.7 70.78,40.33 70.78,40.19 70.31,39.71 69.37,39.71 69.27,39.81 66.72,39.81 58.28,48.25 v58.28,48.56 | 63.89,58.56 TX.C 64.66,58.55 64.97,58.24 v65.28,58.24 | v57.97,50.88 57.97,53.31 v58.47,53.81
  Bottom 0.152: v58.28,48.56 58.28,50.44 v57.97,50.88 | v58.47,53.81 60.53,53.81 64.96,58.24 v65.28,58.24
VIBR_EN  (via drill 0.31)
  Top 0.152: IC3.28 v66.84,48.25 | v92.41,24.88 93.06,24.88 95.94,27.75 95.94,32.81 v95.34,33.41 | v95.34,36.56 76.19,36.56 v75.57,37.18 | v69.22,37.81 69.12,37.91 68.12,37.91 67.34,38.69 66.25,38.69 60.81,44.12 v60.16,44.12 | v63.69,45.56 63.19,45.56 63.03,45.41 62.5,45.41 62.12,45.78 v62.12,48.25
  Top 0.254: Q2.1 104.2,10.45 105.5,11.75 v105.5,18.38
  Bottom 0.152: v105.5,18.38 105.5,19.72 103.75,21.47 95.5,21.47 93.69,23.28 93.5,23.28 92.41,24.38 v92.41,24.88 | v95.34,33.41 v95.34,36.56 | v75.57,37.18 75.39,37.34 75.25,37.49 69.53,37.5 v69.22,37.81 | v60.16,44.12 60.16,44.53 61.16,45.53 62.09,45.53 62.28,45.34 63.47,45.34 v63.69,45.56 | v62.12,48.25 v66.84,48.25
VIBR_EN2  (via drill 0.31)
  Top 0.152: v54.5,35.16 54.5,35.81 55.81,37.12 56.06,37.12 57.09,38.16 57.09,38.44 57.22,38.56 57.22,40 57.69,40.47 57.69,41.88 56.38,43.19 56.38,45.78 54.78,47.38 54.78,49.38 55.19,49.78 55.19,52.25 v56.44,53.5 | IC3.24 69.75,52.23 70.12,52.6 v70.12,53.44
  Top 0.254: Q3.1 42.7,6.7 v42.75,6.75
  Bottom 0.152: v42.75,6.75 42.75,9.5 45.25,12 45.25,13.81 46.22,14.78 46.22,15.81 46.97,16.56 46.97,17.59 46.78,17.78 46.78,28.03 52.75,34 52.91,34 53.47,34.56 53.91,34.56 v54.5,35.16 | v56.44,53.5 57.78,53.5 58.31,52.97 69.65,52.97 v70.12,53.44

## Text on the board
bPlace: VIBR | VIBR | v1.1
bNames: GND | Engineering Tech / Electronics / ICT / Campus Ghent | ADDR SEL / IC7 | ADDR SEL / IC6 | 1 | 0 | 0 | More info on: / dramco.be/dramcontroller / by Guus Leenders, / Jarne Van Mulders | A2 | A2 | A1 | A1 | A0 | 3V3 | SEG1 | 3V3 | SEG2 | A0 | A0 | A0 | A1 | A1 | A2 | GND | GND | A2 | ADDR SEL / IC4 | ADDR SEL / IC5 | + | +
bStop: CONTROLLER
Name: GND | 3V3 | SCL | TX | GND | 3V3 | SCL | TX | D6 | SDA | RX | A0 | D10 | SDA | RX | A4 | GND | INT | 3V3 | GND | INT | 3V3 | 3V3 | SCL | TX | GND | SCL | TX | GND | 3V3 | SCL | TX | GND | SCL | TX | GND | 3V3 | 3V3 | A3 | A7 | D9 | SDA | RX | SDA | RX | A1 | D14 | SDA | RX | SDA | RX | A5 | D7 | D10 | 3V3 | 3V3 | GND | INT | GND | INT | 3V3 | GND | INT | GND | INT | 3V3 | 3V3 | SCL | TX | GND | 3V3 | SCL | TX | GND | D8 | SDA | RX | A2 | D10 | SDA | RX | A6 | GND | INT | 3V3 | GND | INT | 3V3